# EAGLE design SerialKey (EAGLE 6.4)
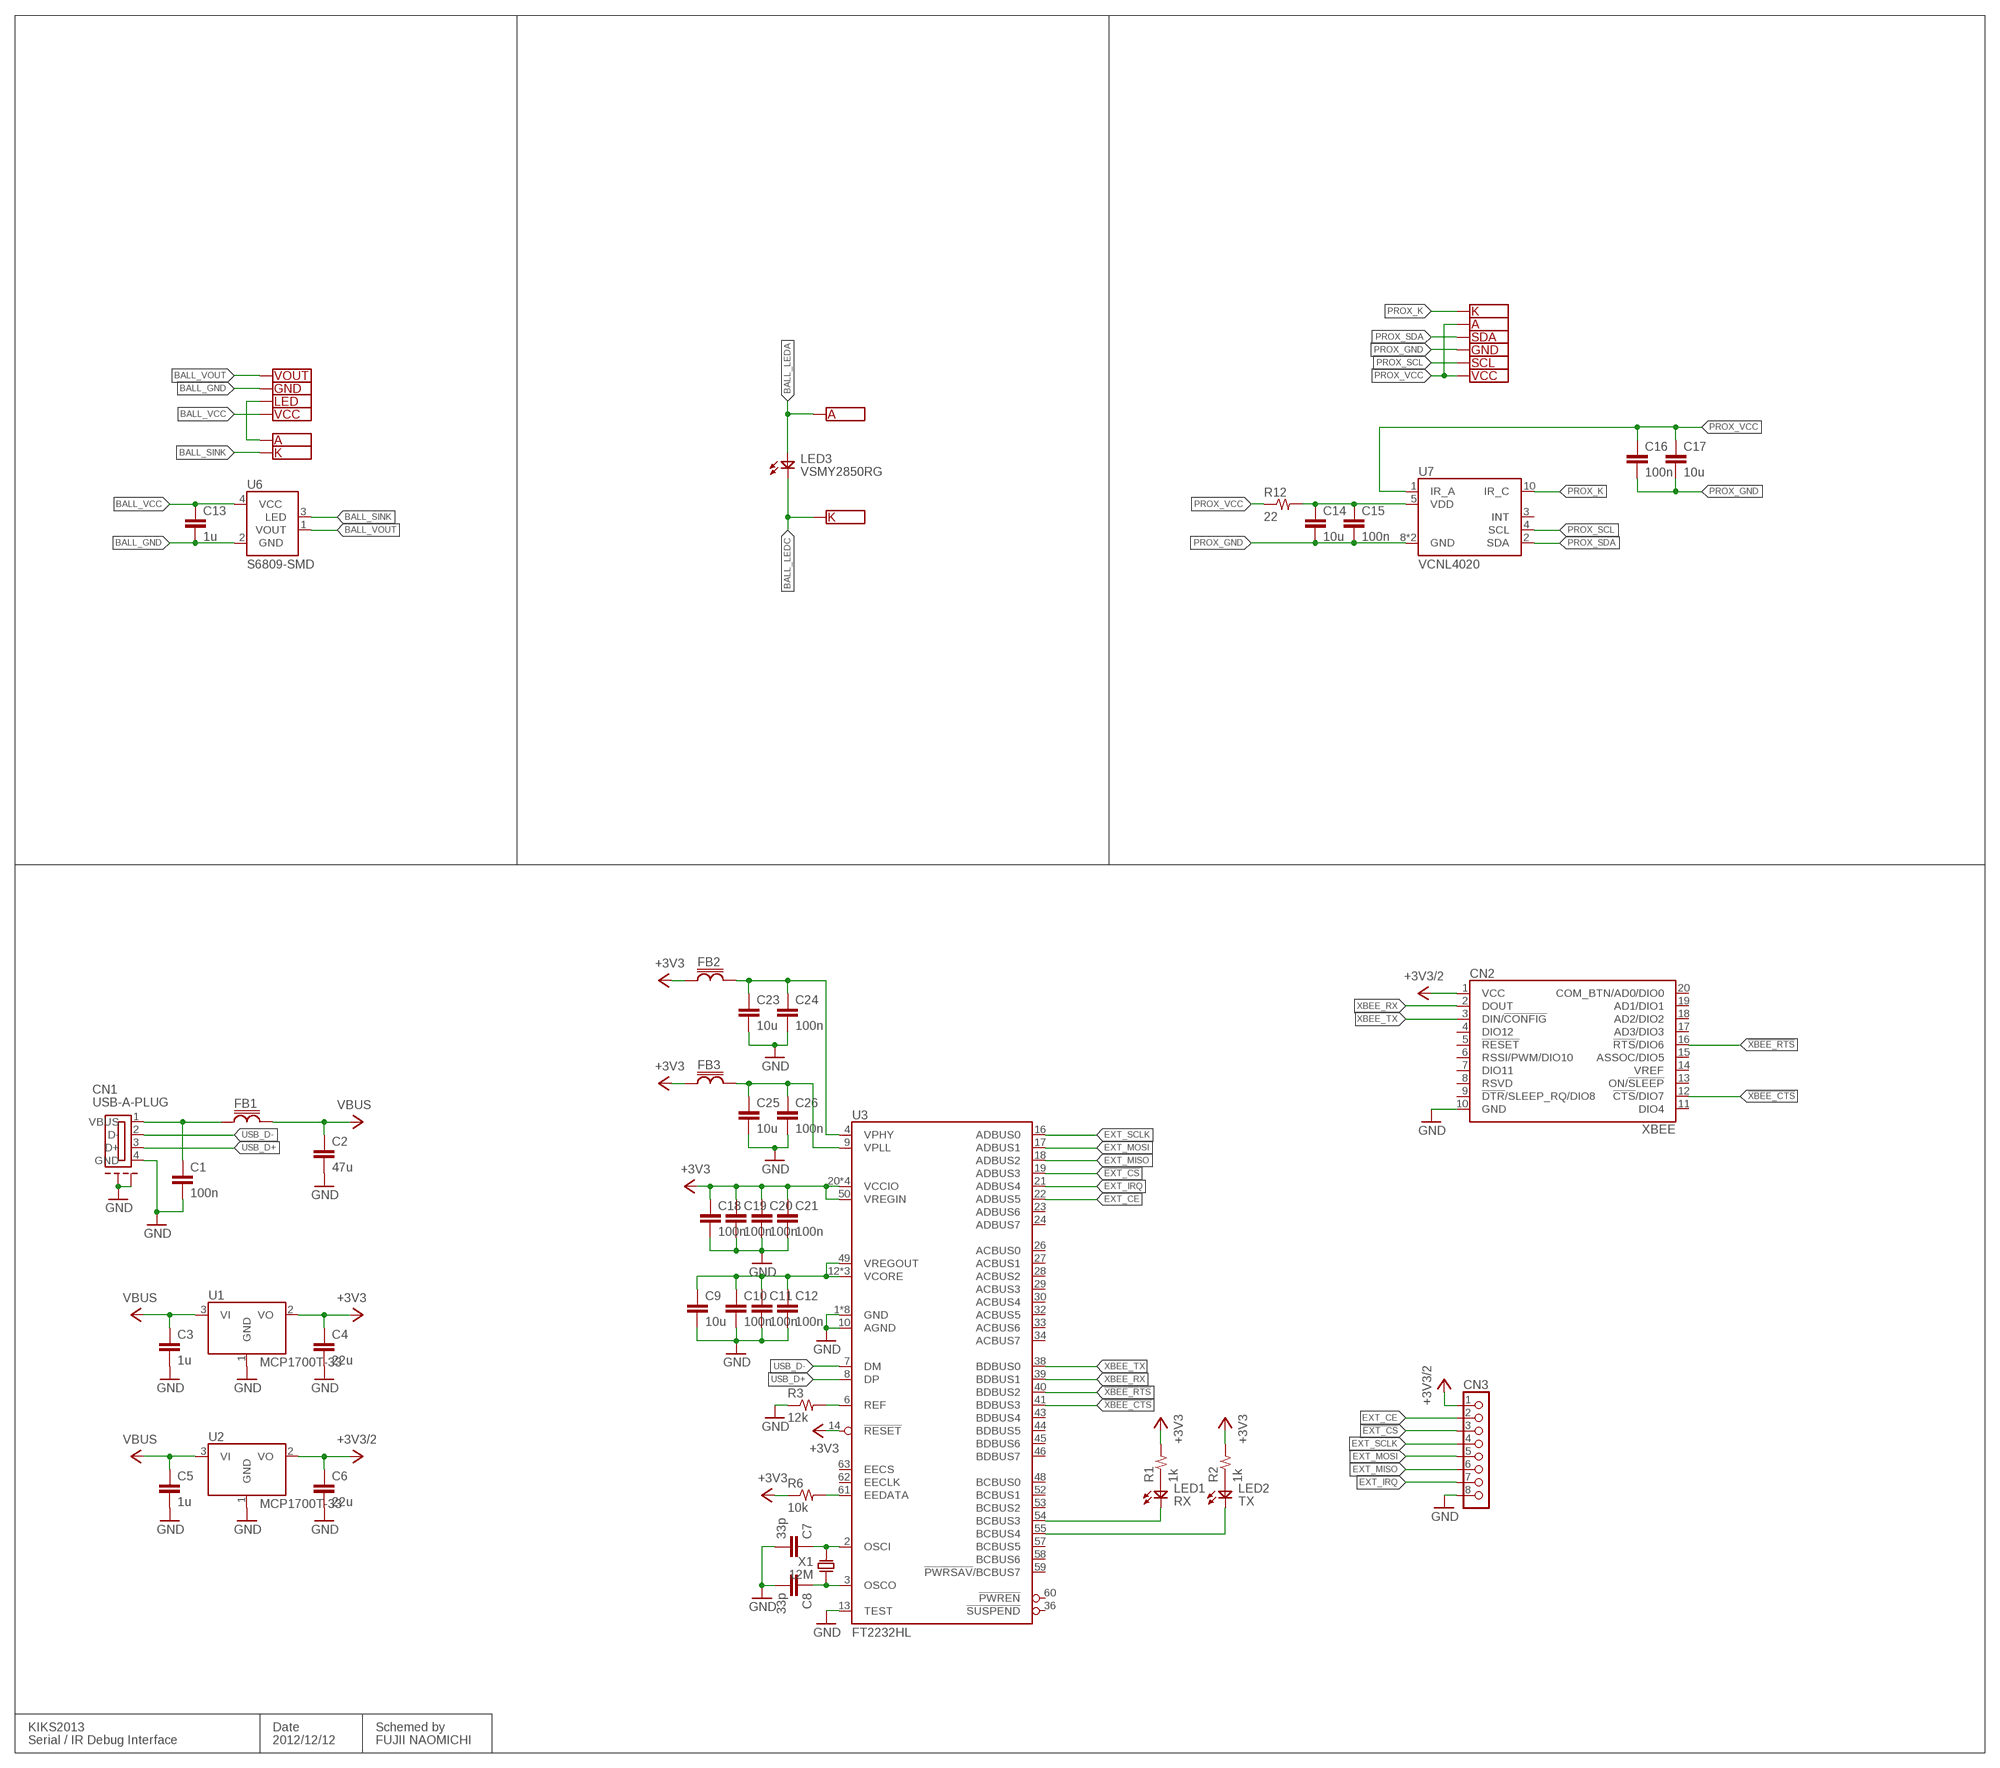
[diagram p0: schematic, sheet 1]

## Parts
C1  100n  C1005  [1005]
C2  47u  C3216  [3216]
C3  1u  C1005  [1005]
C4  22u  C2012  [2012]
C5  1u  C1005  [1005]
C6  22u  C2012  [2012]
C7  33p  C1608  [1608]
C8  33p  C1608  [1608]
C9  10u  C1608  [1608]
C10  100n  C1005  [1005]
C11  100n  C1005  [1005]
C12  100n  C1005  [1005]
C13  1u  C1005  [1005]
C14  10u  C1608  [1608]
C15  100n  C1005  [1005]
C16  100n  C1005  [1005]
C17  10u  C1608  [1608]
C18  100n  C1005  [1005]
C19  100n  C1005  [1005]
C20  100n  C1005  [1005]
C21  100n  C1005  [1005]
C23  10u  C1608  [1608]
C24  100n  C1005  [1005]
C25  10u  C1608  [1608]
C26  100n  C1005  [1005]
CN1  USB-A-PLUG  [USB-A-PLUG]
CN2  XBEE  XBEE-TH-NOSILK  [XBEE-TH-NOSILK]
CN3  PIN1X8  [PIN1X8]
FB1  FB1608  [1608]
FB2  FB1608  [1608]
FB3  FB1608  [1608]
LED1  RX  LED1608  [1608]
LED2  TX  LED1608  [1608]
LED3  VSMY2850RG  [VISHAY-RGW]
R1  1k  R1005  [1005]
R2  1k  R1005  [1005]
R3  12k  R1608  [1608]
R6  10k  R1005  [1005]
R12  22  R1005  [1005]
T1  VOUT  TERMINAL  [TERMINAL]
T2  GND  TERMINAL  [TERMINAL]
T3  LED  TERMINAL  [TERMINAL]
T4  VCC  TERMINAL  [TERMINAL]
T5  A  TERMINAL  [TERMINAL]
T6  K  TERMINAL  [TERMINAL]
T7  A  TERMINAL  [TERMINAL]
T8  K  TERMINAL  [TERMINAL]
T9  SDA  TERMINAL  [TERMINAL]
T10  GND  TERMINAL  [TERMINAL]
T11  SCL  TERMINAL  [TERMINAL]
T12  VCC  TERMINAL  [TERMINAL]
T13  A  TERMINAL  [TERMINAL]
T14  K  TERMINAL  [TERMINAL]
U1  MCP1700T-33  [SOT23-3]
U2  MCP1700T-33  [SOT23-3]
U3  FT2232HL  [QFP64-0.5]
U6  S6809-SMD  [S6809]
U7  VCNL4020  [VCNL4020]
X1  12M  HC49  [HC49]

## Nets
!EXT_CS: CN3.3 U3.19(ADBUS3)
!XBEE_CTS: CN2.12(!CTS!/DIO7) U3.41(BDBUS3)
!XBEE_RTS: CN2.16(!RTS!/DIO6) U3.40(BDBUS2)
+3V3: C4.1 C18.1 C19.1 C20.1 C21.1 FB2.1 FB3.1 R1.2 R2.2 R6.1 U1.2(VO) U3.14(!RESET) U3.20(VCCIO) U3.31(VCCIO) U3.42(VCCIO) U3.50(VREGIN) U3.56(VCCIO)
+3V3/2: C6.1 CN2.1(VCC) CN3.1 U2.2(VO)
BALL_GND: C13.2 T2.1 U6.2(GND)
BALL_LEDA: LED3.A T7.1
BALL_LEDC: LED3.K T8.1
BALL_SINK: T6.1 U6.3(LED)
BALL_VCC: C13.1 T4.1 U6.4(VCC)
BALL_VOUT: T1.1 U6.1(VOUT)
EXT_CE: CN3.2 U3.22(ADBUS5)
EXT_IRQ: CN3.7 U3.21(ADBUS4)
EXT_MISO: CN3.6 U3.18(ADBUS2)
EXT_MOSI: CN3.5 U3.17(ADBUS1)
EXT_SCLK: CN3.4 U3.16(ADBUS0)
GND: C1.2 C2.2 C3.2 C4.2 C5.2 C6.2 C7.2 C8.2 C9.2 C10.2 C11.2 C12.2 C18.2 C19.2 C20.2 C21.2 C23.2 C24.2 C25.2 C26.2 CN1.4(GND) CN1.S1 CN1.S2 CN2.10(GND) CN3.8 R3.1 U1.1(GND) U2.1(GND) U3.1(GND) U3.5(GND) U3.10(AGND) U3.11(GND) U3.13(TEST) U3.15(GND) U3.25(GND) U3.35(GND) U3.47(GND) U3.51(GND)
N$1: C1.1 CN1.1(VBUS) FB1.1
N$2: R3.2 U3.6(REF)
N$4: C9.1 C10.1 C11.1 C12.1 U3.12(VCORE) U3.37(VCORE) U3.49(VREGOUT) U3.64(VCORE)
N$5: LED1.A R1.1
N$6: LED2.A R2.1
N$7: LED1.K U3.54(BCBUS3)
N$8: LED2.K U3.55(BCBUS4)
N$10: C23.1 C24.1 FB2.2 U3.4(VPHY)
N$11: C25.1 C26.1 FB3.2 U3.9(VPLL)
N$14: T3.1 T5.1
N$16: R6.2 U3.61(EEDATA)
N$17: C14.1 C15.1 R12.2 U7.5(VDD)
N$21: C7.1 U3.2(OSCI) X1.1(A)
N$22: C8.1 U3.3(OSCO) X1.2(B)
PROX_GND: C14.2 C15.2 C16.2 C17.2 T10.1 U7.8(GND) U7.9(GND)
PROX_K: T14.1 U7.10(IR_C)
PROX_SCL: T11.1 U7.4(SCL)
PROX_SDA: T9.1 U7.2(SDA)
PROX_VCC: C16.1 C17.1 R12.1 T12.1 T13.1 U7.1(IR_A)
USB_D+: CN1.3(D+) U3.8(DP)
USB_D-: CN1.2(D-) U3.7(DM)
VBUS: C2.1 C3.1 C5.1 FB1.2 U1.3(VI) U2.3(VI)
XBEE_RX: CN2.2(DOUT) U3.39(BDBUS1)
XBEE_TX: CN2.3(DIN/!CONFIG) U3.38(BDBUS0)
Unconnected: CN2.4(DIO12) CN2.5(!RESET) CN2.6(RSSI/PWM/DIO10) CN2.7(DIO11) CN2.8(RSVD) CN2.9(!DTR!/SLEEP_RQ/DIO8) CN2.11(DIO4) CN2.13(ON/!SLEEP) CN2.14(VREF) CN2.15(ASSOC/DIO5) CN2.17(AD3/DIO3) CN2.18(AD2/DIO2) CN2.19(AD1/DIO1) CN2.20(COM_BTN/AD0/DIO0) U3.23(ADBUS6) U3.24(ADBUS7) U3.26(ACBUS0) U3.27(ACBUS1) U3.28(ACBUS2) U3.29(ACBUS3) U3.30(ACBUS4) U3.32(ACBUS5) U3.33(ACBUS6) U3.34(ACBUS7) U3.36(!SUSPEND) U3.43(BDBUS4) U3.44(BDBUS5) U3.45(BDBUS6) U3.46(BDBUS7) U3.48(BCBUS0) U3.52(BCBUS1) U3.53(BCBUS2) U3.57(BCBUS5) U3.58(BCBUS6) U3.59(!PWRSAV!/BCBUS7) U3.60(!PWREN) U3.62(EECLK) U3.63(EECS) U7.3(INT)

## Notes on the sheet
- KIKS2013 | Date | Schemed by
- Serial / IR Debug Interface | 2012/12/12 | FUJII NAOMICHI

## Library data of the parts
C1-C21 C23-C26 = Passive:C
CN1 = Connector:USB-A-PLUG
CN2 = Connector:XBEE-*
CN3 = Connector:PIN1X8
FB1-FB3 = Passive:FB
LED1 LED2 = Opto:LED
LED3 = Opto:VSMY2850
R1-R3 R6 R12 = Passive:R
T1-T14 = ic-package:TERMINAL
U1 U2 = ic-Microchip:MCP1700T-*
U3 = ic-FTDI:FT2232H
U6 = ProjectOnly:S6809
U7 = ic-Vishay:VCNL4020
X1 = Oscillator:HC49

## Board
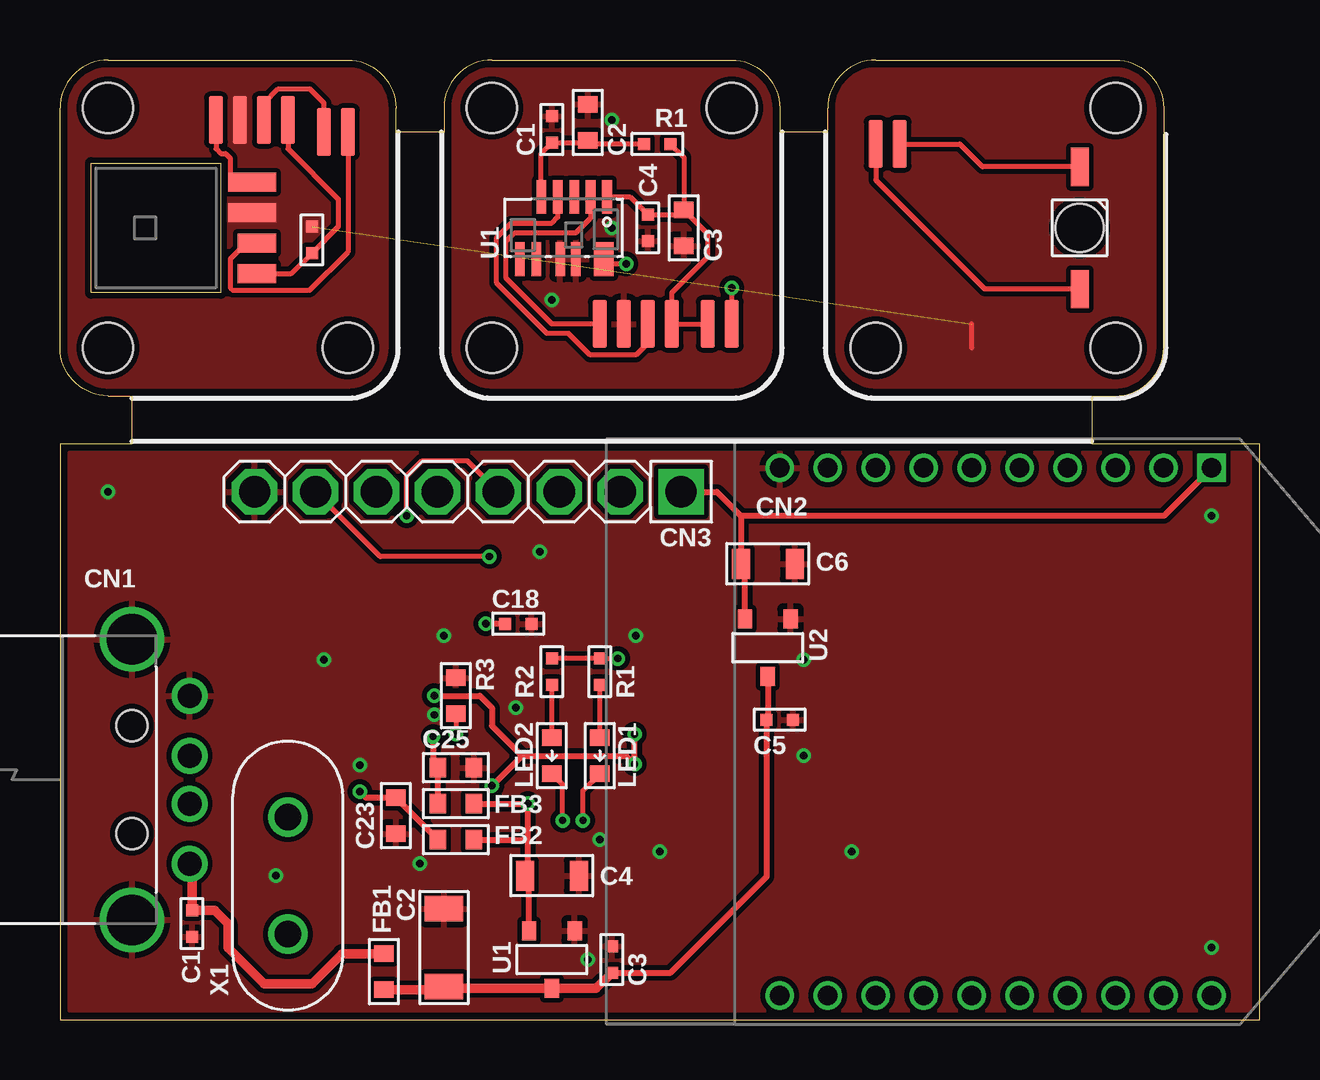
[diagram p1: board, top side]
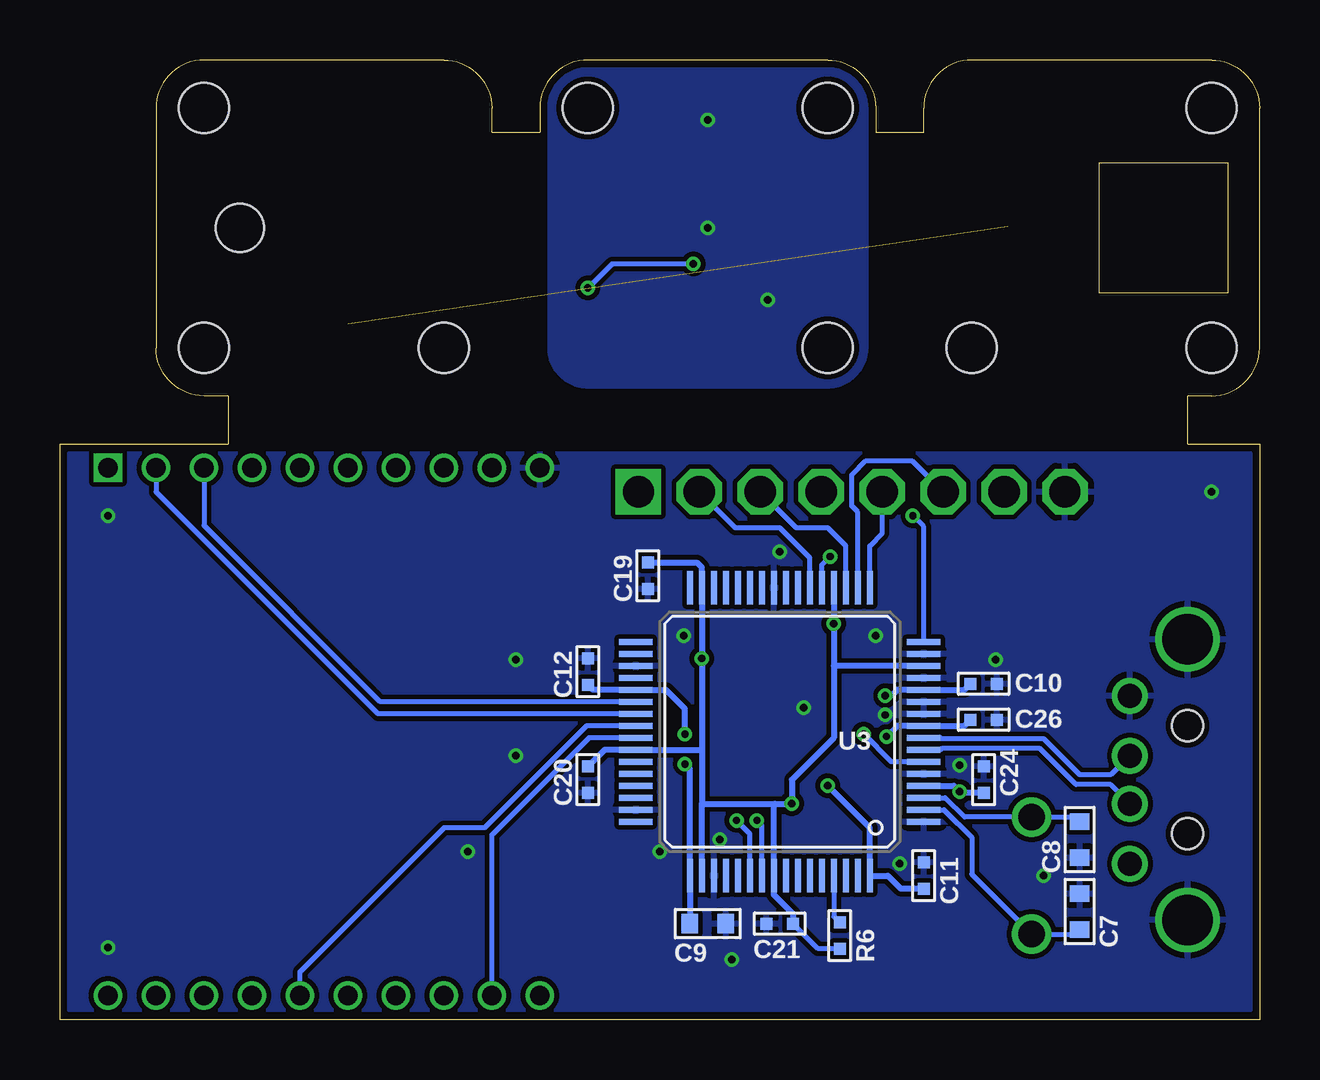
[diagram p2: board, bottom side, seen from below]

Size 50 x 40 mm. Coordinates in mm from the lower left corner, seen from the top.
Outline: 0,0 50,0 50,24 43,24 43,26 44,26 arc90 46,28 46,38 arc90 44,40 34,40 arc90 32,38 32,37 30,37 30,38 arc90 28,40 18,40 arc90 16,38 16,37 14,37 14,38 arc90 12,40 2,40 arc90 0,38 0,28 arc90 2,26 3,26 3,24 0,24 0,0
Copper layers (1*16): Top 0.035mm / dielectric 1.6mm / Bottom 0.035mm
Design rules "seeedstudio *": minimum track width 6mil, minimum drill 0.3mm, track to track 6mil, track to pad 6mil, pad to pad 6mil, via to via 6mil, smd to smd 6mil, copper to edge 10mil, drill to drill 10mil, minimum pad ring 0.2mm, minimum via ring 6mil, stop-mask expansion 4mil, vias tented up to drill 3mm, thermal gap 10mil
Holes 2.1 mm at 2,38 2,28 12,28 44,38 44,28 34,28 18,38 28,38 18,28
tRestrict: 24 lines
bRestrict: 8 lines

### Footprints (pad centres in the part's own frame; a part is rotated, then mirrored left to right if it is on the bottom)
1005 = smd 0.5 x 0.5: 1 -0.55,0; 2 0.55,0
3216 = smd 1.05 x 1.6: 1 -1.625,0; 2 1.625,0
2012 = smd 0.75 x 1.25: 1 -1.125,0; 2 1.125,0
1608 = smd 0.7 x 0.8: 1 -0.75,0; 2 0.75,0
USB-A-PLUG = drill 1: 1 3.5,2.4; 2 1,2.4; 3 -1,2.4; 4 -3.5,2.4 | drill 2.1 pad 2.7: S1 -5.85,0; S2 5.85,0 | hole 1.3: -2.25,0; 2.25,0
XBEE-TH-NOSILK = drill 0.8 square: 1 -11,9 | drill 0.8: 2 -11,7; 3 -11,5; 4 -11,3; 5 -11,1; 6 -11,-1; 7 -11,-3; 8 -11,-5; 9 -11,-7; 10 -11,-9; 11 11,-9; 12 11,-7; 13 11,-5; 14 11,-3; 15 11,-1; 16 11,1; 17 11,3; 18 11,5; 19 11,7; 20 11,9
PIN1X8 = drill 1.3 pad 1.9 square: 1 -8.89,0 | drill 1.3 pad 1.9 octagon: 2 -6.35,0; 3 -3.81,0; 4 -1.27,0; 5 1.27,0; 6 3.81,0; 7 6.35,0; 8 8.89,0
1608' = smd 0.7 x 0.8: A 0.75,0; K -0.75,0
VISHAY-RGW = smd 1.6 x 0.75: A -2.55,0; K 2.55,0 | hole 2: 0,0
TERMINAL = smd 2 x 0.6: 1 0,0
SOT23-3 = smd 0.6 x 0.8: 1 -0.95,-1.2; 2 0.95,-1.2; 3 0,1.2
QFP64-0.5 = smd 1.4 x 0.25: 1 -6,3.75; 2 -6,3.25; 3 -6,2.75; 4 -6,2.25; 5 -6,1.75; 6 -6,1.25; 7 -6,0.75; 8 -6,0.25; 9 -6,-0.25; 10 -6,-0.75; 11 -6,-1.25; 12 -6,-1.75; 13 -6,-2.25; 14 -6,-2.75; 15 -6,-3.25; 16 -6,-3.75; 33 6,-3.75; 34 6,-3.25; 35 6,-2.75; 36 6,-2.25; 37 6,-1.75; 38 6,-1.25; 39 6,-0.75; 40 6,-0.25; 41 6,0.25; 42 6,0.75; 43 6,1.25; 44 6,1.75; 45 6,2.25; 46 6,2.75; 47 6,3.25; 48 6,3.75 | smd 0.25 x 1.4: 17 -3.75,-6; 18 -3.25,-6; 19 -2.75,-6; 20 -2.25,-6; 21 -1.75,-6; 22 -1.25,-6; 23 -0.75,-6; 24 -0.25,-6; 25 0.25,-6; 26 0.75,-6; 27 1.25,-6; 28 1.75,-6; 29 2.25,-6; 30 2.75,-6; 31 3.25,-6; 32 3.75,-6; 49 3.75,6; 50 3.25,6; 51 2.75,6; 52 2.25,6; 53 1.75,6; 54 1.25,6; 55 0.75,6; 56 0.25,6; 57 -0.25,6; 58 -0.75,6; 59 -1.25,6; 60 -1.75,6; 61 -2.25,6; 62 -2.75,6; 63 -3.25,6; 64 -3.75,6
S6809 = smd 0.8 x 2: 1 1.905,-4; 2 0.635,-4 | smd 0.8 x 1.6: 3 -0.635,-4.2; 4 -1.905,-4.2
VCNL4020 = smd 0.4 x 1.4: 1 -1.8,-1.3; 2 -1.115,-1.3; 3 -0.43,-1.3; 4 0.255,-1.3; 5 0.94,-1.3; 6 1.83,1.3; 7 1.15,1.3; 8 0.15,1.3; 9 -0.5,1.3 | smd 0.83 x 1.4: 10 -1.665,1.3
HC49 = drill 1.1: 1 -2.44,0; 2 2.44,0

### Placement (x,y rotation side)
C1  5.5,4 270 top
C2  16,3 90 top
C3  23,2.5 90 top
C4  20.5,6 0 top
C5  30,12.5 0 top
C6  29.5,19 0 top
C7  7.5,4.5 90 bottom
C8  7.5,7.5 270 bottom
C9  23,4 0 bottom
C10  11.5,14 0 bottom
C11  14,6 90 bottom
C12  28,14.5 90 bottom
C13  10.5,32.5 90 top
C14  22,37.4 90 top
C15  20.5,37.1 90 top
C16  24.5,33 270 top
C17  26,33 270 top
C18  19.1,16.5 0 top
C19  25.5,18.5 270 bottom
C20  28,10 270 bottom
C21  20,4 180 bottom
C23  14,8.5 270 top
C24  11.5,10 90 bottom
C25  16.5,10.5 0 top
C26  11.5,12.5 0 bottom
CN1  3,10 270 top
CN2  39,12 270 top
CN3  17,22 180 top
FB1  13.5,2 270 top
FB2  16.5,7.5 180 top
FB3  16.5,9 180 top
LED1  RX  [1608']  22.5,11 90 top
LED2  TX  [1608']  20.5,11 90 top
LED3  42.5,33 270 top
R1  22.5,14.5 90 top
R2  20.5,14.5 90 top
R3  16.5,13.5 270 top
R6  17.5,3.5 90 bottom
R12  24.9,36.5 180 top
T1  6.5,37.5 90 top
T2  7.5,37.5 90 top
T3  8.5,37.5 90 top
T4  9.5,37.5 90 top
T5  11,37 90 top
T6  12,37 90 top
T7  35,36.5 270 top
T8  34,36.5 270 top
T9  22.5,29 270 top
T10  23.5,29 270 top
T11  24.5,29 270 top
T12  25.5,29 270 top
T13  27,29 270 top
T14  28,29 270 top
U1  20.5,2.5 180 top
U2  29.5,15.5 180 top
U3  20,12 180 bottom
U6  4,33 90 top
U7  21,33 180 top
X1  9.5,6 90 top

### Tracks (layer width: path | path; a pad name or v marks a point on that pad's centre or on a via)
!EXT_CS
  Bottom 0.2: U3.19 17.25,19.75 18,20.5 19.31,20.5 CN3.3
!XBEE_CTS
  Bottom 0.2: U3.41 27.95,11.75 32,7.7 CN2.12
!XBEE_RTS
  Bottom 0.2: U3.40 28.05,12.25 32.3,8 34,8 40,2 CN2.16
+3V3  (via drill 0.3)
  Top 0.2: v23.25,15.05 R1.2 R2.2
  Top 0.25: U1.2 19.55,5.83 C4.1 19.5,6.12 19.5,7.6 | 19.5,7.6 v19.5,9 FB3.1 | FB2.1 19.4,7.5 19.5,7.6 | C18.1 v17.75,16.5
  Bottom 0.2: R6.1 18.4,2.95 C21.1
  Bottom 0.25: C21.1 19.45,4.4 20.25,5.2 U3.56 20.25,8.95 20.2,9 | U3.50 23.25,9 | 23.25,9 20.2,9 | 20.2,9 v19.5,9 19.5,10 17.75,11.75 17.75,14.75 | U3.20 v17.75,16.5 17.75,14.75 | U3.14 17.75,14.75 | 23.25,11.25 v23.25,15.05 U3.31 23.25,18.85 23.45,19.05 C19.1 | 23.25,11.25 23.25,9 | 23.25,11.25 U3.42 27.3,11.25 C20.1
+3V3/2
  Top 0.25: U2.2 28.55,18.82 C6.1 28.38,21 | CN2.1 46,21 28.38,21 | CN3.1 27.38,22 28.38,21
BALL_GND  (1 unrouted)
  Top 0.2: 38,28 38,29
  pour Top (isolate 0.2, rank 5, no thermals): -0.4,40.4 14.4,40.4 14.4,25.6 -0.4,25.6
  pour Top (isolate 0.2, rank 5, no thermals): 31.6,40.4 46.4,40.4 46.4,25.6 31.6,25.6
BALL_LEDA
  Top 0.2: T7.1 37.5,36.5 38.45,35.55 LED3.A
BALL_LEDC
  Top 0.2: T8.1 34,35 38.55,30.45 LED3.K
BALL_SINK
  Top 0.2: T6.1 12,32 10.4,30.4 7.2,30.4 7.1,30.5 7.1,31.7 7.76,32.37 U6.3
BALL_VCC
  Top 0.2: U6.4 9.64,31.09 C13.1 11.6,33.05 11.6,34.2 9.5,36.3 T4.1
BALL_VOUT
  Top 0.2: T1.1 6.5,36.3 6.7,36.1 6.9,36.1 7.1,35.9 7.1,34.91 U6.1
EXT_CE
  Bottom 0.2: U3.22 18.75,19.25 20,20.5 21.85,20.5 CN3.2
EXT_IRQ  (via drill 0.3)
  Top 0.2: v17.9,19.3 13.35,19.3 CN3.7
  Bottom 0.2: U3.21 18.25,18.95 v17.9,19.3
EXT_MISO
  Bottom 0.2: U3.18 16.75,21.15 17,21.4 17,22.7 16.4,23.3 14.49,23.3 CN3.6
EXT_MOSI
  Bottom 0.2: U3.17 16.25,19.75 15.73,20.27 CN3.5
EXT_SCLK  (via drill 0.3)
  Top 0.2: v14.45,21 14.45,22.65 15.1,23.3 16.97,23.3 CN3.4
  Bottom 0.2: U3.16 14,20.55 v14.45,21
GND  (via drill 0.3)
  other vias: 2,22 48,21 48,3 25,7 24,16 31,15 31,11 11,15 15.6,12.7 9,6 15,6.5 22.5,7.5 20,19.5 12.5,10.6 33,7 16,16 19,13 22,2.5
  pour Top (isolate 0.2, rank 6): 0.4,23.6 0.4,0.4 49.6,0.4 49.6,23.6
  pour Bottom (isolate 0.2, rank 6): 0.4,23.6 0.4,0.4 49.6,0.4 49.6,23.6
N$1
  Top 0.4: CN1.1 5.5,6.4 C1.1 6.45,4.55 7,4 7,3 8.5,1.5 10.5,1.5 11.75,2.75 FB1.1
N$2  (via drill 0.3)
  Top 0.2: R3.2 v16.5,11.9
  Bottom 0.2: U3.6 15.35,10.75 v16.5,11.9
N$4  (via drill 0.3)
  Top 0.25: v23.95,11.9 v23.95,10.65 23.6,11 19.25,11 | v15.6,13.5 17.5,13.5 18,13 18,12.25 19.25,11 | v18,9.75 19.25,11
  Bottom 0.25: C10.1 12.3,13.75 U3.12 15.1,13.75 15.35,13.5 v15.6,13.5 | C11.1 14.95,5.45 15.5,6 U3.64 16.25,8 v18,9.75 | C9.1 U3.49 23.75,10.45 v23.95,10.65 | v23.95,11.9 23.95,12.95 24.75,13.75 U3.37 27.8,13.75 C12.1
N$5
  Top 0.2: LED1.A R1.1
N$6
  Top 0.2: LED2.A R2.1
N$7  (via drill 0.3)
  Top 0.2: v21.8,8.3 21.8,9.55 LED1.K
  Bottom 0.2: U3.54 21.25,7.75 v21.8,8.3
N$8  (via drill 0.3)
  Top 0.2: v20.95,8.3 20.95,9.8 LED2.K
  Bottom 0.2: U3.55 20.75,8.1 v20.95,8.3
N$10  (via drill 0.3)
  Top 0.25: FB2.2 C23.1 12.75,9.25 v12.5,9.5
  Bottom 0.25: C24.1 12.45,9.45 v12.5,9.5 12.75,9.75 U3.4
N$11  (via drill 0.3)
  Top 0.25: v15.55,11.8 15.55,10.7 C25.1 FB3.2
  Bottom 0.25: C26.1 12.3,12.25 U3.9 15.1,12.25 v15.55,11.8
N$14
  Top 0.2: T3.1 8.5,38.2 9.1,38.8 10.4,38.8 11,38.2 T5.1
N$16
  Bottom 0.2: U3.61 17.75,4.3 R6.2
N$17
  Top 0.2: R12.2 22.15,36.5 C14.1 21.9,36.55 C15.1 20.06,36.11 U7.5
N$21
  Bottom 0.2: C7.1 7.69,3.56 X1.1 12,6.06 12,7.6 13.15,8.75 U3.2
N$22
  Bottom 0.2: U3.3 13.1,9.25 12.29,8.44 X1.2 7.69,8.44 C8.1
PROX_GND  (via drill 0.3)
  other vias: 23,33 23,37.5 20.5,30
  pour Top (isolate 0.2, rank 5): 15.6,40.4 30.4,40.4 30.4,25.6 15.6,25.6
  pour Bottom (isolate 0.2, rank 5): 15.6,40.4 30.4,40.4 30.4,25.6 15.6,25.6
PROX_K  (via drill 0.3)
  Top 0.2: T14.1 v28,30.5 | v23.6,31.5 22.86,31.5 U7.10
  Bottom 0.2: v23.6,31.5 27,31.5 v28,30.5
PROX_SCL
  Top 0.2: T11.1 24.5,28.2 24,27.7 22.1,27.7 21.2,28.6 20.3,28.6 18.2,30.7 18.2,32.6 18.8,33.2 20.5,33.2 20.75,33.45 U7.4
PROX_SDA
  Top 0.2: T9.1 20.5,29 18.6,30.9 18.6,32.45 18.95,32.8 21.5,32.8 22.11,33.41 U7.2
PROX_VCC
  Top 0.2: T13.1 T12.1 25.5,30.3 27,31.8 27,32.75 C17.1 | C17.1 25.8,33.55 C16.1 23.75,34.3 U7.1 | R12.1 26,35.95 C17.1
USB_D+
  Bottom 0.2: CN1.3 6.2,10.2 7.5,10.2 9,11.7 13.25,11.7 13.3,11.75 U3.8
USB_D-
  Bottom 0.2: CN1.2 6.2,9.8 7.65,9.8 9.15,11.3 13.25,11.3 13.3,11.25 U3.7
VBUS
  Top 0.25: C3.1 25.45,1.95 29.45,5.95 C5.1 29.5,12.55 U2.3
  Top 0.4: FB1.2 15.88,1.25 C2.1 16.07,1.3 U1.3 22.35,1.3 C3.1
XBEE_RX
  Bottom 0.2: U3.39 36.75,12.75 46,22 CN2.2
XBEE_TX
  Bottom 0.2: U3.38 36.65,13.25 44,20.6 CN2.3

### Text on the board
tNames: R1 | C1 | C2 | C4 | U1 | C3